# Altium schematic sheet SheetESP.SchDoc
size A4; SheetNumber: 1; SheetTotal: 1
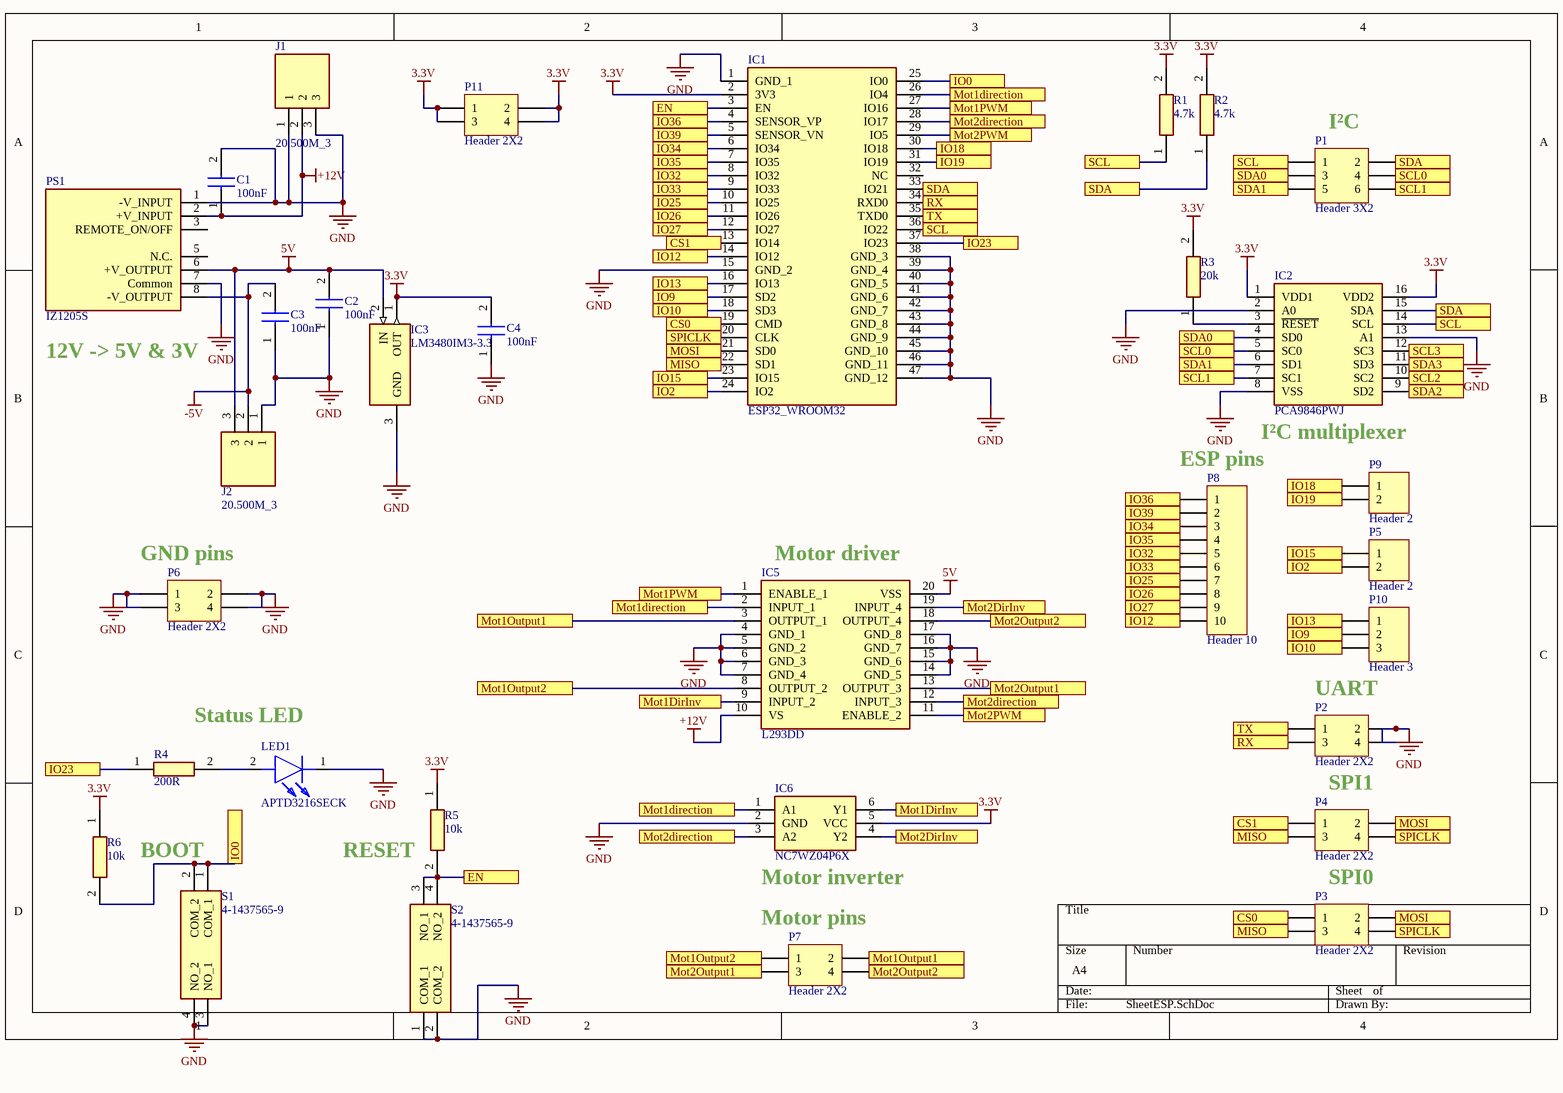
[diagram p0: SheetESP.SchDoc]

## Parts
C1  100nF  [CAPC2012X94N]
C2  100nF  [CAPC2012X94N]
C3  100nF  [CAPC2012X94N]
C4  100nF  [CAPC2012X94N]
IC1  ESP32_WROOM32  [ESP32WROOM32]
IC2  PCA9846PWJ  [SOP65P640X110-16N]
IC3  LM3480IM3-3.3  [SOT95P237X112-3N]
IC5  L293DD  [SOIC127P1032X265-20N]
IC6  NC7WZ04P6X  [SOT65P210X110-6N]
J1  20.500M_3  [20500M3]
J2  20.500M_3  [20500M3]
LED1  APTD3216SECK  [APTD3216SECK]
P1  Header 3X2  [HDR2X3]
P2  Header 2X2  [HDR2X2]
P3  Header 2X2  [HDR2X2]
P4  Header 2X2  [HDR2X2]
P5  Header 2  [HDR1X2]
P6  Header 2X2  [HDR2X2]
P7  Header 2X2  [HDR2X2]
P8  Header 10  [HDR1X10]
P9  Header 2  [HDR1X2]
P10  Header 3  [HDR1X3]
P11  Header 2X2  [HDR2X2]
PS1  IZ1205S  [IZ1205S]
R1  4.7k  [RESC2012X65N]
R2  4.7k  [RESC2012X65N]
R3  20k  [RESC2012X65N]
R4  200R  [RESC2012X65N]
R5  10k  [RESC2012X65N]
R6  10k  [RESC2012X65N]
S1  4-1437565-9  [414375659]
S2  4-1437565-9  [414375659]

## Ports
CS0, CS1, EN, IO0, IO2, IO9, IO10, IO12, IO13, IO15, IO18, IO19, IO23, IO25, IO26, IO27, IO32, IO33, IO34, IO35, IO36, IO39, MISO, MOSI, Mot1direction, Mot1DirInv, Mot1Output1, Mot1Output2, Mot1PWM, Mot2direction, Mot2DirInv, Mot2Output1, Mot2Output2, Mot2PWM, RX, SCL, SCL0, SCL1, SCL2, SCL3, SDA, SDA0, SDA1, SDA2, SDA3, SPICLK, TX

## Nets
3.3V: C4.2 IC1.2(3V3) IC2.1(VDD1) IC2.16(VDD2) IC3.1(OUT) IC6.5(VCC) P11.1 P11.2 P11.3 P11.4 R1.2 R2.2 R3.2 R5.1 R6.1
5V: C2.2 IC3.2(IN) IC5.20(VSS) J2.3 PS1.6(+V_OUTPUT)
+12V: C1.1 IC5.10(VS) J1.2 PS1.2(+V_INPUT)
-5V: C3.2 J2.2 PS1.8(-V_OUTPUT)
GND: C1.2 C2.1 C3.1 C4.1 IC1.1(GND_1) IC1.15(GND_2) IC1.38(GND_3) IC1.39(GND_4) IC1.40(GND_5) IC1.41(GND_6) IC1.42(GND_7) IC1.43(GND_8) IC1.44(GND_9) IC1.45(GND_10) IC1.46(GND_11) IC1.47(GND_12) IC2.2(A0) IC2.8(VSS) IC2.13(A1) IC3.3(GND) IC5.4(GND_1) IC5.5(GND_2) IC5.6(GND_3) IC5.7(GND_4) IC5.14(GND_5) IC5.15(GND_6) IC5.16(GND_7) IC5.17(GND_8) IC6.2(GND) J1.1 J1.3 J2.1 LED1.1(K) P2.2 P2.4 P6.1 P6.2 P6.3 P6.4 PS1.1(-V_INPUT) PS1.7(Common) S1.3(NO_1) S1.4(NO_2) S2.1(COM_1) S2.2(COM_2)
CS0: IC1.19(CMD) P3.1 ; port CS0
CS1: IC1.13(IO14) P4.1 ; port CS1
EN: IC1.3(EN) R5.2 S2.3(NO_1) S2.4(NO_2) ; port EN
IO0: IC1.25(IO0) R6.2 S1.1(COM_1) S1.2(COM_2) ; port IO0
IO2: IC1.24(IO2) P5.2 ; port IO2
IO9: IC1.17(SD2) P10.2 ; port IO9
IO10: IC1.18(SD3) P10.3 ; port IO10
IO12: IC1.14(IO12) P8.10 ; port IO12
IO13: IC1.16(IO13) P10.1 ; port IO13
IO15: IC1.23(IO15) P5.1 ; port IO15
IO18: IC1.30(IO18) P9.1 ; port IO18
IO19: IC1.31(IO19) P9.2 ; port IO19
IO23: IC1.37(IO23) R4.1 ; port IO23
IO25: IC1.10(IO25) P8.7 ; port IO25
IO26: IC1.11(IO26) P8.8 ; port IO26
IO27: IC1.12(IO27) P8.9 ; port IO27
IO32: IC1.8(IO32) P8.5 ; port IO32
IO33: IC1.9(IO33) P8.6 ; port IO33
IO34: IC1.6(IO34) P8.3 ; port IO34
IO35: IC1.7(IO35) P8.4 ; port IO35
IO36: IC1.4(SENSOR_VP) P8.1 ; port IO36
IO39: IC1.5(SENSOR_VN) P8.2 ; port IO39
MISO: IC1.22(SD1) P3.3 P4.3 ; port MISO
MOSI: IC1.21(SD0) P3.2 P4.2 ; port MOSI
Mot1direction: IC1.26(IO4) IC5.2(INPUT_1) IC6.1(A1) ; port Mot1direction
Mot1DirInv: IC5.9(INPUT_2) IC6.6(Y1) ; port Mot1DirInv
Mot1Output1: IC5.3(OUTPUT_1) P7.2 ; port Mot1Output1
Mot1Output2: IC5.8(OUTPUT_2) P7.1 ; port Mot1Output2
Mot1PWM: IC1.27(IO16) IC5.1(ENABLE_1) ; port Mot1PWM
Mot2direction: IC1.28(IO17) IC5.12(INPUT_3) IC6.3(A2) ; port Mot2direction
Mot2DirInv: IC5.19(INPUT_4) IC6.4(Y2) ; port Mot2DirInv
Mot2Output1: IC5.13(OUTPUT_3) P7.3 ; port Mot2Output1
Mot2Output2: IC5.18(OUTPUT_4) P7.4 ; port Mot2Output2
Mot2PWM: IC1.29(IO5) IC5.11(ENABLE_2) ; port Mot2PWM
RX: IC1.34(RXD0) P2.3 ; port RX
SCL: IC1.36(IO22) IC2.14(SCL) P1.1 R1.1 ; port SCL
SCL0: IC2.5(SC0) P1.4 ; port SCL0
SCL1: IC2.7(SC1) P1.6 ; port SCL1
SCL2: IC2.10(SC2) ; port SCL2
SCL3: IC2.12(SC3) ; port SCL3
SDA: IC1.33(IO21) IC2.15(SDA) P1.2 R2.1 ; port SDA
SDA0: IC2.4(SD0) P1.3 ; port SDA0
SDA1: IC2.6(SD1) P1.5 ; port SDA1
SDA2: IC2.9(SD2) ; port SDA2
SDA3: IC2.11(SD3) ; port SDA3
SPICLK: IC1.20(CLK) P3.4 P4.4 ; port SPICLK
TX: IC1.35(TXD0) P2.1 ; port TX
NetIC2_3: IC2.3(~{RESET}) R3.1
NetLED1_2: LED1.2(A) R4.2

Not connected (* = marked no-connect by the designer): IC1 32(NC); PS1 3(REMOTE_ON/OFF) 5(N.C.)

## Notes on the sheet
- (near P1) I²C
- (near PS1) 12V -> 5V & 3V
- I²C multiplexer
- (near P8) ESP pins
- (near P6) GND pins
- (near IC5) Motor driver
- Status LED
- UART
- SPI1
- BOOT
- RESET
- (near IC6) Motor inverter
- (near P7) Motor pins
- SPI0

## Library data of the parts
C1-C4 = 08055A130JAT2A: Capacitor; Manufacturer_Name: AVX; Datasheet Link: https://componentsearchengine.com/Datasheets/1/06031A100FAT2A.pdf; Height: 0.94mm; Manufacturer_Part_Number: 08055A130JAT2A; Mouser Part Number: 581-08055A130JAT2A; Mouser Price/Stock: https://www.mouser.com/Search/Refine.aspx?Keyword=581-08055A130JAT2A
IC1 = ESP32_WROOM32: Integrated Circuit; Manufacturer_Name: Espressif Systems; Manufacturer_Part_Number: ESP32 WROOM32; Datasheet Link: https://www.espressif.com/sites/default/files/documentation/esp32-wroom-32_datasheet_en.pdf; Height: 3.2mm
IC2 = PCA9846PWJ: Integrated Circuit; Manufacturer_Name: NXP; Datasheet Link: http://www.nxp.com/docs/en/data-sheet/PCA9846.pdf; Height: 1.1mm; Manufacturer_Part_Number: PCA9846PWJ; Mouser Part Number: 771-PCA9846PWJ; Mouser Price/Stock: https://www.mouser.com/Search/Refine.aspx?Keyword=771-PCA9846PWJ
IC3 = LM3480IM3-3.3: Integrated Circuit; Manufacturer_Name: Texas Instruments; Datasheet Link: http://www.ti.com/lit/ds/symlink/lm3480.pdf; Height: 1.12mm; Manufacturer_Part_Number: LM3480IM3-3.3; Mouser Part Number: 926-LM3480IM3-33; Mouser Price/Stock: https://www.mouser.co.uk/ProductDetail/Texas-Instruments/LM3480IM3-33/?qs=X1J7HmVL2ZF9L3Vb4i2kPg%3D%3D; Arrow Part Number: LM3480IM3-3.3; Arrow Price/Stock: https://www.arrow.com/en/products/lm3480im3-3.3/texas-instruments
IC5 = L293DD: Integrated Circuit; Manufacturer_Name: STMicroelectronics; Datasheet Link: https://www.st.com/resource/en/datasheet/l293d.pdf; Height: 2.65mm; Manufacturer_Part_Number: L293DD; Mouser Part Number: 511-L293DD; Mouser Price/Stock: https://www.mouser.co.uk/ProductDetail/STMicroelectronics/L293DD?qs=m4gxtLzGBzoksItTiSkcgg%3D%3D; Arrow Part Number: L293DD; Arrow Price/Stock: https://www.arrow.com/en/products/l293dd/stmicroelectronics
IC6 = NC7WZ04P6X: Integrated Circuit; Manufacturer_Name: ON Semiconductor; Datasheet Link: http://docs-emea.rs-online.com/webdocs/0f9b/0900766b80f9b620.pdf; Height: 1.1mm; Manufacturer_Part_Number: NC7WZ04P6X; Mouser Part Number: 512-NC7WZ04P6X; Mouser Price/Stock: https://www.mouser.co.uk/ProductDetail/ON-Semiconductor-Fairchild/NC7WZ04P6X?qs=CR8BwU6haLfI%2Fe3Upy6lhw%3D%3D; Arrow Part Number: NC7WZ04P6X; Arrow Price/Stock: https://www.arrow.com/en/products/nc7wz04p6x/on-semiconductor
J1 J2 = 20.500M_3: Connector; Manufacturer_Name: RS Components; Manufacturer_Part_Number: 20.500M/3; Datasheet Link: https://docs.rs-online.com/d681/0900766b8157a573.pdf; Height: 10.2mm
LED1 = APTD3216SECK: LED; Manufacturer_Name: Kingbright; Datasheet Link: https://componentsearchengine.com/Datasheets/1/APTD3216SECK.pdf; Height: 1.8mm; Manufacturer_Part_Number: APTD3216SECK; Mouser Part Number: 604-APTD-3216SECK; Mouser Price/Stock: https://www.mouser.com/Search/Refine.aspx?Keyword=604-APTD-3216SECK; Arrow Part Number: APTD3216SECK; Arrow Price/Stock: https://www.arrow.com/en/products/aptd3216seck/kingbright
P1 = Header 3X2: Header, 3-Pin, Dual row; LatestRevisionDate: 17-Jul-2002; LatestRevisionNote: Re-released for DXP Platform.; Publisher: Altium Limited
P2-P4 P6 P7 P11 = Header 2X2: Header, 2-Pin, Dual row; LatestRevisionDate: 17-Jul-2002; LatestRevisionNote: Re-released for DXP Platform.; Publisher: Altium Limited
P5 P9 = Header 2: Header, 2-Pin; LatestRevisionDate: 17-Jul-2002; LatestRevisionNote: Re-released for DXP Platform.; Publisher: Altium Limited
P8 = Header 10: Header, 10-Pin; LatestRevisionDate: 17-Jul-2002; LatestRevisionNote: Re-released for DXP Platform.; Publisher: Altium Limited
P10 = Header 3: Header, 3-Pin; LatestRevisionDate: 17-Jul-2002; LatestRevisionNote: Re-released for DXP Platform.; Publisher: Altium Limited
PS1 = IZ1205S: Power Supply; Manufacturer_Name: XP POWER; Datasheet Link: https://www.xppower.com/portals/0/pdfs/SF_IZ.pdf; Height: 11.1mm; Manufacturer_Part_Number: IZ1205S; Mouser Part Number: 209-IZ1205S; Mouser Price/Stock: https://www.mouser.co.uk/ProductDetail/XP-Power/IZ1205S?qs=w%2Fv1CP2dgqrcXpexIyZ%252BMg%3D%3D
R1-R6 = CRG0805F100K: Resistor; Manufacturer_Name: TE Connectivity; Datasheet Link: http://www.te.com/commerce/DocumentDelivery/DDEController?Action=showdoc&DocId=Customer+Drawing%7F1623109%7FBA%7Fpdf%7FEnglish%7FENG_CD_1623109_BA.pdf%7F1623109-1; Height: 0.65mm; Manufacturer_Part_Number: CRG0805F100K; Mouser Part Number: 279-CRG0805F100K; Mouser Price/Stock: https://www.mouser.co.uk/ProductDetail/TE-Connectivity-Neohm/CRG0805F100K?qs=VHcS2MTj4gaSH6styLNYqg%3D%3D; Arrow Part Number: CRG0805F100K; Arrow Price/Stock: https://www.arrow.com/en/products/crg0805f100k/te-connectivity
S1 S2 = 4-1437565-9: Switch; Manufacturer_Name: TE Connectivity; Datasheet Link: http://www.te.com/commerce/DocumentDelivery/DDEController?Action=showdoc&DocId=Customer+Drawing%7F2-1437565-7%7FV%7Fpdf%7FEnglish%7FENG_CD_2-1437565-7_V.pdf%7F4-1437565-9; Height: 10mm; Manufacturer_Part_Number: 4-1437565-9; Mouser Part Number: N/A; Mouser Price/Stock: https://www.mouser.com/Search/Refine.aspx?Keyword=N%2FA; Arrow Part Number: 4-1437565-9; Arrow Price/Stock: https://www.arrow.com/en/products/4-1437565-9/te-connectivity